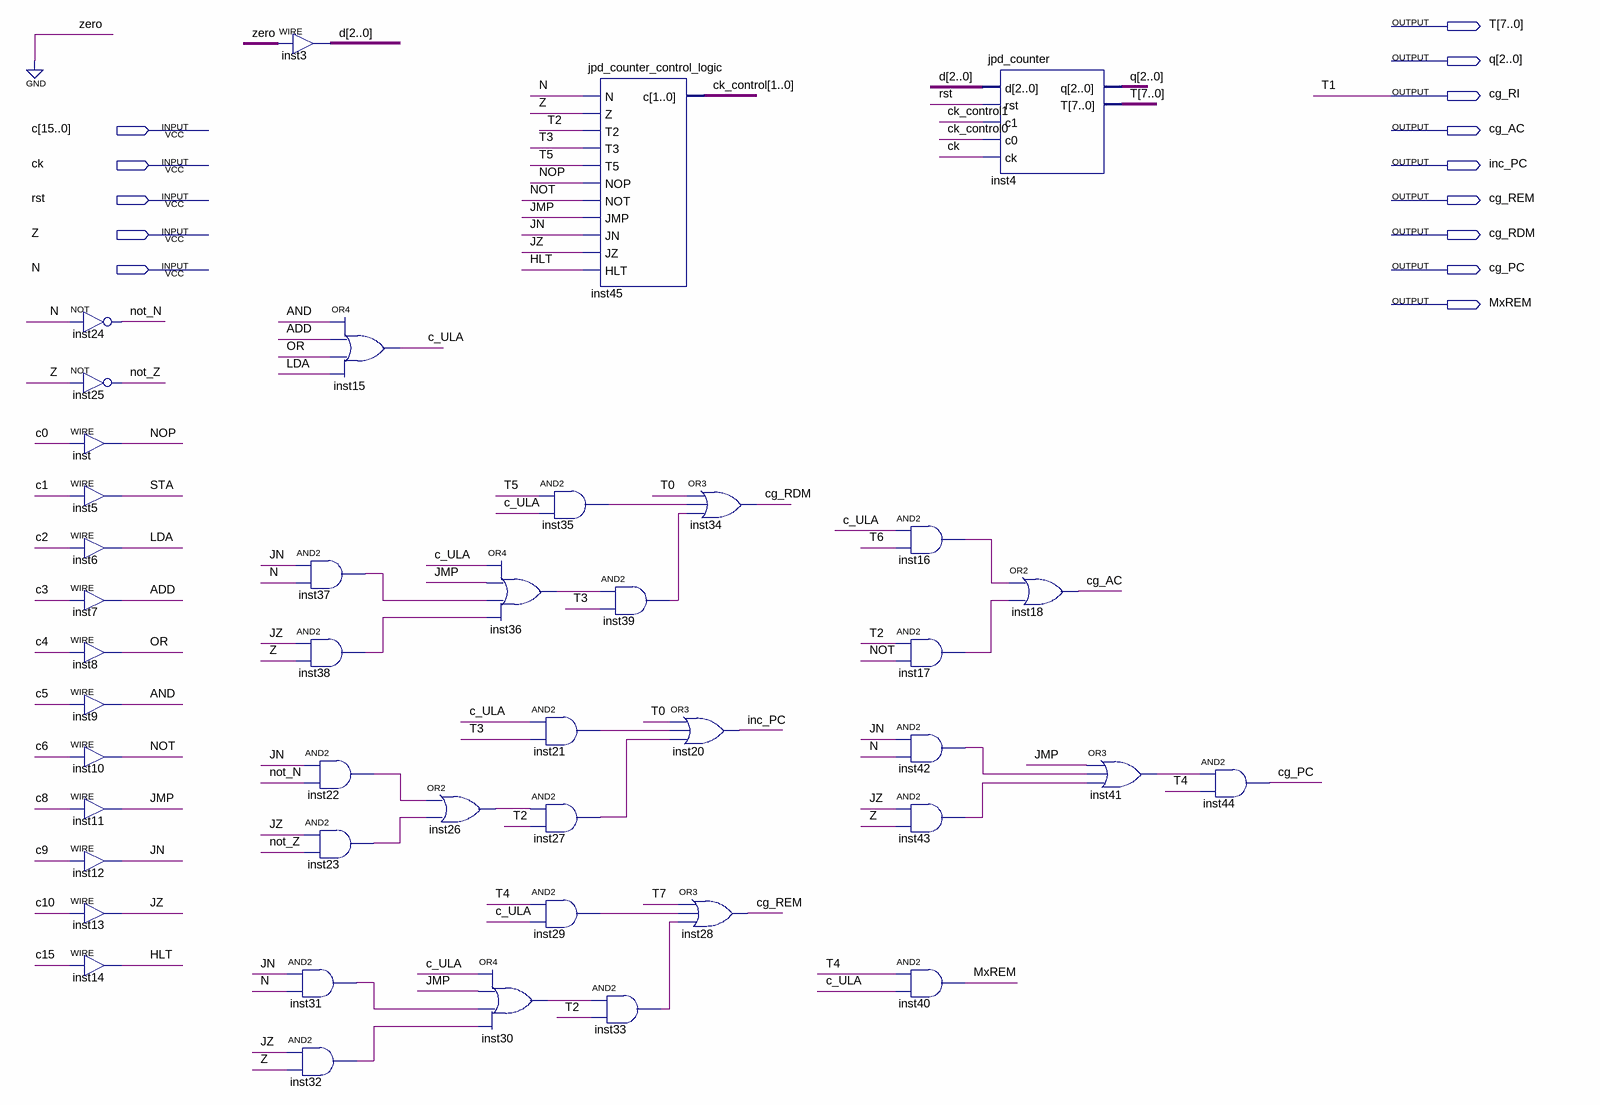
[diagram p0: schematic sheet]
// Quartus schematic jpd_control.bdf as structural Verilog: 43 symbols, 14 pins
module jpd_control (
  input  [15:0] c,
  input  ck,
  input  rst,
  input  Z,
  input  N,
  output [7:0] T,
  output [2:0] q,
  output cg_RI,
  output cg_AC,
  output inc_PC,
  output cg_REM,
  output cg_RDM,
  output cg_PC,
  output MxREM
);

  wire ADD, AND, c_ULA, HLT, inst16_out, inst17_out, inst21_out, inst22_out, inst23_out, inst26_out,
       inst27_out, inst29_out, inst30_out, inst31_out, inst32_out, inst33_out, inst35_out, inst36_out,
       inst37_out, inst38_out, inst39_out, inst41_out, inst42_out, inst43_out, JMP, JN, JZ, LDA, NOP, NOT,
       not_N, not_Z, OR, STA;
  wire [1:0] ck_control;
  wire [2:0] d;

  not inst24 (not_N, N);
  not inst25 (not_Z, Z);
  assign NOP = c[0];  // WIRE inst
  assign STA = c[1];  // WIRE inst5
  assign LDA = c[2];  // WIRE inst6
  assign ADD = c[3];  // WIRE inst7
  assign OR = c[4];  // WIRE inst8
  assign AND = c[5];  // WIRE inst9
  assign NOT = c[6];  // WIRE inst10
  assign JMP = c[8];  // WIRE inst11
  assign JN = c[9];  // WIRE inst12
  assign JZ = c[10];  // WIRE inst13
  assign HLT = c[15];  // WIRE inst14
  assign d = 3'b000;  // WIRE inst3
  or inst15 (c_ULA, AND, ADD, OR, LDA);
  and inst37 (inst37_out, JN, N);
  and inst38 (inst38_out, JZ, Z);
  and inst22 (inst22_out, JN, not_N);
  and inst23 (inst23_out, JZ, not_Z);
  and inst31 (inst31_out, JN, N);
  and inst32 (inst32_out, JZ, Z);
  or inst26 (inst26_out, inst22_out, inst23_out);
  and inst35 (inst35_out, T[5], c_ULA);
  or inst36 (inst36_out, c_ULA, JMP, inst37_out, inst38_out);
  and inst21 (inst21_out, c_ULA, T[3]);
  and inst27 (inst27_out, inst26_out, T[2]);
  and inst29 (inst29_out, T[4], c_ULA);
  or inst30 (inst30_out, c_ULA, JMP, inst31_out, inst32_out);
  jpd_counter_control_logic inst45 (
    .N(N), .Z(Z), .T2(T[2]), .T3(T[3]), .T5(T[5]), .NOP(NOP), .NOT(NOT), .JMP(JMP), .JN(JN), .JZ(JZ),
    .HLT(HLT), .c(ck_control));
  and inst39 (inst39_out, inst36_out, T[3]);
  and inst33 (inst33_out, inst30_out, T[2]);
  or inst20 (inc_PC, T[0], inst21_out, inst27_out);
  or inst28 (cg_REM, T[7], inst29_out, inst33_out);
  or inst34 (cg_RDM, T[0], inst35_out, inst39_out);
  and inst16 (inst16_out, c_ULA, T[6]);
  and inst17 (inst17_out, T[2], NOT);
  and inst42 (inst42_out, JN, N);
  and inst43 (inst43_out, JZ, Z);
  and inst40 (MxREM, T[4], c_ULA);
  jpd_counter inst4 (
    .d(d), .rst(rst), .c1(ck_control[1]), .c0(ck_control[0]), .ck(ck), .q(q), .T({T[7:2], cg_RI, T[0]}));
  or inst18 (cg_AC, inst16_out, inst17_out);
  or inst41 (inst41_out, JMP, inst42_out, inst43_out);
  and inst44 (cg_PC, inst41_out, T[4]);

  assign T[1] = cg_RI;

  // Other names for the same wires on the sheet: T1 = cg_RI
endmodule
